# EAGLE design tps610891-boost-to-vin-flashlight-driver-tester-mk-1.0.0 (EAGLE 9.2.2)
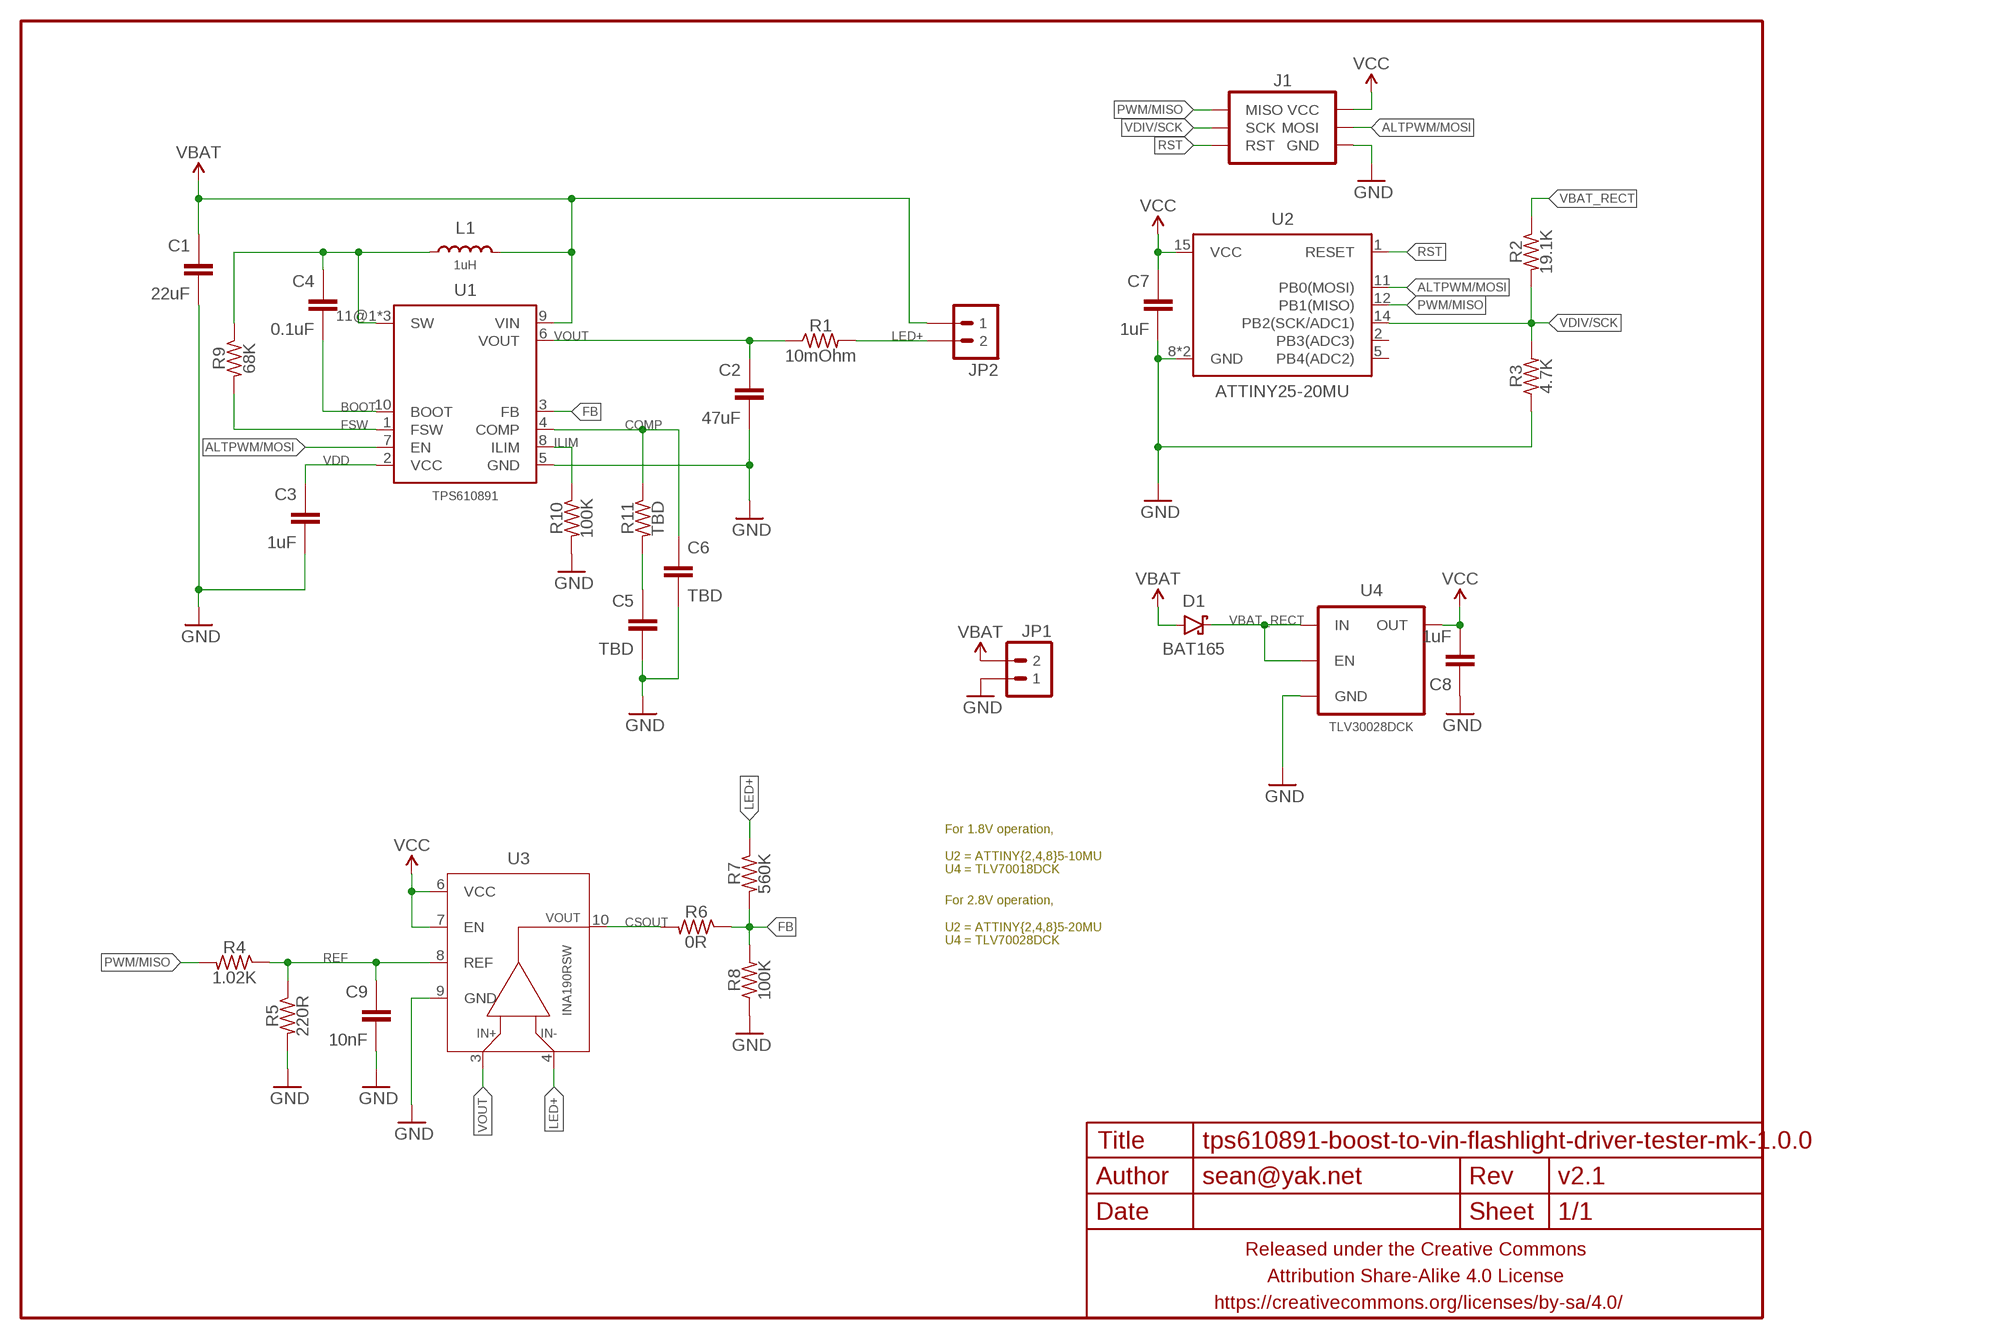
[diagram p0: schematic, sheet 1]

## Parts
C1  22uF  CAPACITOR-CERAMICC1206  [C1206]
C2  47uF  CAPACITOR-CERAMICC1206  [C1206]
C3  1uF  CAPACITOR-CERAMICC0402  [C0402]
C4  0.1uF  CAPACITOR-CERAMICC0402  [C0402]
C5  TBD  CAPACITOR-CERAMICC0402  [C0402]
C6  TBD  CAPACITOR-CERAMICC0402  [C0402]
C7  1uF  CAPACITOR-CERAMICC0402  [C0402]
C8  1uF  CAPACITOR-CERAMICC0402  [C0402]
C9  10nF  CAPACITOR-CERAMICC0402  [C0402]
D1  BAT165  DIODE-SCHOTTKYSOD323  [SOD323-SCHOTTKY]
FRAME1  FRAME-LETTERNO_PACKAGE  [DUMMY]
J1  AVR_SPI_PRG_6PTH  [2X3]
JP1  M021X02_NO_SILK  [1X02_NO_SILK]
JP2  M021X02_NO_SILK  [1X02_NO_SILK]
L1  1uH  INDUCTORXAL60XX  [XAL60XX]
R1  10mOhm  RESISTORR1206  [R1206]
R2  19.1K  RESISTORR0402  [R0402]
R3  4.7K  RESISTORR0402  [R0402]
R4  1.02K  RESISTORR0402  [R0402]
R5  220R  RESISTORR0402  [R0402]
R6  0R  RESISTORR0402  [R0402]
R7  560K  RESISTORR0402  [R0402]
R8  100K  RESISTORR0402  [R0402]
R9  68K  RESISTORR0402  [R0402]
R10  100K  RESISTORR0402  [R0402]
R11  TBD  RESISTORR0402  [R0402]
U1  TPS610891  TPS61089X  [VQFN-11]
U2  ATTINY25-20MU  ATTINY45TINY85-20-QFN  [QFN20]
U3  INA190RSW  [UQFN-10]
U4  TLV30028DCK  V_REG_ENTLV700XXDCR  [SC70]

## Nets
ALTPWM/MOSI: J1.4(MOSI) U1.7(EN) U2.11(PB0(MOSI))
BOOT: C4.2 U1.10(BOOT)
COMP: C6.1 R11.1 U1.4(COMP)
CSOUT: R6.2 U3.10(OUT)
FB: R6.1 R7.2 R8.2 U1.3(FB)
FSW: R9.2 U1.1(FSW)
GND: C1.2 C2.2 C3.2 C5.2 C6.2 C7.2 C8.1 C9.2 J1.6(GND) JP1.1 R3.1 R5.2 R8.1 R10.2 U1.5(GND) U2.8(GND) U2.PAD(GND) U3.9(GND) U4.2(GND)
ILIM: R10.1 U1.8(ILIM)
LED+: JP2.2 R1.2 R7.1 U3.4(VIN-)
N$1: C4.1 L1.P$1 R9.1 U1.11@1(SW) U1.11@2(SW) U1.11@3(SW)
N$5: C5.1 R11.2
PWM/MISO: J1.1(MISO) R4.2 U2.12(PB1(MISO))
REF: C9.1 R4.1 R5.1 U3.8(REF)
RST: J1.5(RST) U2.1(RESET)
VBAT: C1.1 D1.A JP1.2 JP2.1 L1.P$2 U1.9(VIN)
VBAT_RECT: D1.C R2.1 U4.1(IN) U4.3(EN)
VCC: C7.1 C8.2 J1.2(VCC) U2.15(VCC) U3.6(VCC) U3.7(EN) U4.5(OUT)
VDD: C3.1 U1.2(VCC)
VDIV/SCK: J1.3(SCK) R2.2 R3.2 U2.14(PB2(SCK/ADC1))
VOUT: C2.1 R1.1 U1.6(VOUT) U3.3(VIN+)
Unconnected: U2.2(PB3(ADC3)) U2.5(PB4(ADC2))

## Notes on the sheet
- For 1.8V operation,
  
  U2 = ATTINY{2,4,8}5-10MU
  U4 = TLV70018DCK
- For 2.8V operation,
  
  U2 = ATTINY{2,4,8}5-20MU
  U4 = TLV70028DCK

## Library data of the parts
C1-C9 = a_parts:CAPACITOR-CERAMIC: CAPACITOR, European symbol
D1 = a_parts:DIODE-SCHOTTKY: Schottky diodes in SFE's production catalog BAT20J 1A 23V 0.62Vf RB751 120mA 40V 0.37Vf PMEG4005EJ 0.5A 40V 0.42Vf MBRA140 1A 40V 0.5Vf B340A 3A 40V SMA
FRAME1 = a_parts:FRAME-LETTER: Schematic Frame Standard 8.5x11 US Letter frame; DESIGNER: sean@yak.net; VERSION: v2.1
J1 = a_parts:AVR_SPI_PRG_6: AVR ISP 6 Pin This is the reduced ISP connector for AVR programming. Common on Arduino. This footprint will take up less PCB space and can be used with a 10-pin to 6-pin adapter such as SKU: BOB-08508 **Special note about "TEST_POINT" package. The stop mask is on the top side, so if you want your programming test points to be on the bottom of your board, make sure to place this package on the bottom side of the board. This also ensure that the orientation to program from the bottom side will be correct.
JP1 JP2 = a_parts:M02: Standard 2-pin 0.1" header. Use with - straight break away headers ( PRT-00116) - right angle break away headers (PRT-00553) - swiss pins (PRT-00743) - machine pins (PRT-00117) - female headers (PRT-00115) Molex polarized connector foot print use with: PRT-08233 with associated crimp pins and housings. 2.54_SCREWTERM for use with PRT-10571. 3.5mm Screw Terminal footprints for PRT-08084 5mm Screw Terminal footprints for use with PRT-08433
L1 = a_parts:INDUCTOR: Inductors Basic Inductor/Choke - 0603 and 1206. Footprints are not proven and vary greatly between part numbers. SRN6045- 33uH, 20% 1.4A SDR0403-560KL - 56uH, 10%, 500mA RMS/740mA peak
R1-R11 = a_parts:RESISTOR: RESISTOR, American symbol
U1 = a_parts:TPS61089X
U2 = a_parts:ATTINY45: Atmel 8-pin 2/4/8kB flash uC
U3 = a_parts:INA190
U4 = a_parts:V_REG_EN

## Board
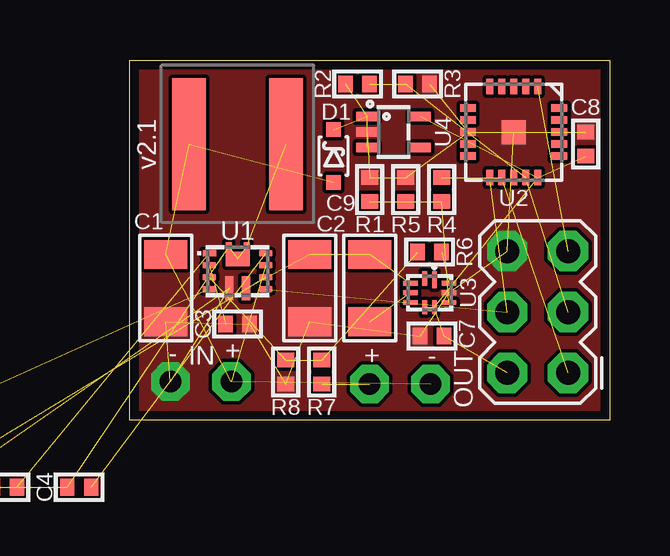
[diagram p1: board, top side]
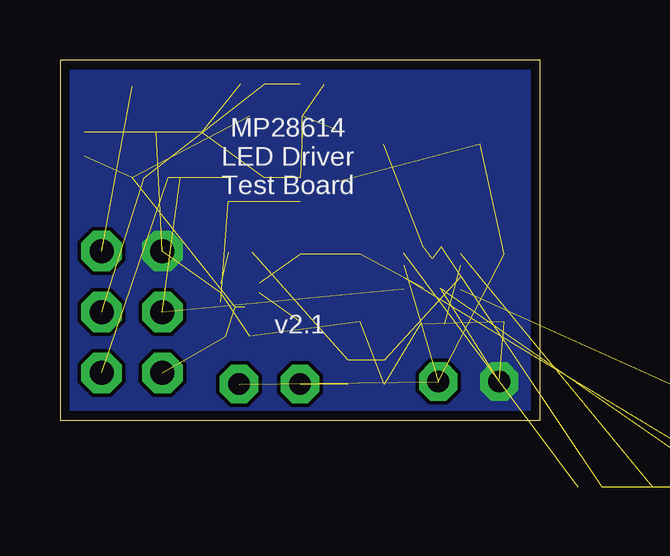
[diagram p2: board, bottom side, seen from below]

Size 20 x 15 mm. Coordinates in mm from the lower left corner, seen from the top.
Outline: 20,0 0,0 0,15 20,15 20,0
Copper layers (1*16): Top 0.035559375mm / dielectric 1.6mm / Bottom 0.035559375mm
Design rules "oshpark-2layer": minimum track width 6mil, minimum drill 10mil, track to track 6mil, track to pad 6mil, pad to pad 6mil, via to via 6mil, smd to smd 0mil, copper to edge 15mil, drill to drill 6mil, minimum pad ring 5mil, minimum via ring 5mil, stop-mask expansion 2.5mil, vias tented up to drill 20mil, thermal gap 10mil

### Footprints (pad centres in the part's own frame; a part is rotated, then mirrored left to right if it is on the bottom)
C1206 = smd 1.2 x 1.8: 1 -1.4,0; 2 1.4,0
C0402 = smd 0.6 x 0.7: 1 -0.5,0; 2 0.5,0
SOD323-SCHOTTKY = smd 0.6 x 0.6: A -1.1,0; C 1.1,0
2X3 = drill 1 pad 1.676 octagon: 1 -2.54,-1.27; 2 -2.54,1.27; 3 0,-1.27; 4 0,1.27; 5 2.54,-1.27; 6 2.54,1.27
1X02_NO_SILK = drill 0.9 pad 1.6 octagon: 1 0,0; 2 2.54,0
XAL60XX = smd 1.4 x 5.5: P$1 -2.02,0; P$2 2.02,0
R1206 = smd 1.2 x 1.8: 1 -1.4,0; 2 1.4,0
R0402 = smd 0.6 x 0.7: 1 -0.5,0; 2 0.5,0
VQFN-11 = smd 0.55 x 0.25: 1 -1.175,0.75; 2 -1.175,0.25; 3 -1.175,-0.25; 4 -1.175,-0.75; 7 1.175,-0.75; 8 1.175,-0.25; 9 1.175,0.25; 10 1.175,0.75 | smd 0.35 x 1: 5 -0.35,-0.7; 6 0.35,-0.7 | smd 1 x 0.62: 11@1 0,0.51 | smd 0.25 x 0.38: 11@2 -0.375,1.01; 11@3 0.375,1.01
QFN20 = smd 0.65 x 0.3: 1 -1.9,1; 2 -1.9,0.5; 3 -1.9,0; 4 -1.9,-0.5; 5 -1.9,-1; 11 1.9,-1; 12 1.9,-0.5; 13 1.9,0; 14 1.9,0.5; 15 1.9,1 | smd 0.3 x 0.65: 6 -1,-1.9; 7 -0.5,-1.9; 8 0,-1.9; 9 0.5,-1.9; 10 1,-1.9; 16 1,1.9; 17 0.5,1.9; 18 0,1.9; 19 -0.5,1.9; 20 -1,1.9 | smd 1 x 1: PAD 0,0
UQFN-10 = smd 0.2 x 0.7: 1 -0.2,-0.55 | smd 0.2 x 0.6: 2 0.2,-0.6; 6 0.2,0.6; 7 -0.2,0.6 | smd 0.6 x 0.2: 3 0.8,-0.4; 4 0.8,0; 5 0.8,0.4; 8 -0.8,0.4; 9 -0.8,0; 10 -0.8,-0.4
SC70 = smd 0.4 x 0.9: 1 -0.65,-1.1; 2 0,-1.1; 3 0.65,-1.1; 4 0.65,1.1; 5 -0.65,1.1

### Placement (x,y rotation side)
C1  1.5,5.5 270 top
C2  7.5,5.5 270 top
C3  4.5,4 0 top
C4  -2.1,-2.8 0 top
C5  -11.4,-2.8 0 top  (outside the outline)
C6  -17.6,-2.8 0 top  (outside the outline)
C7  12.6,3.5 180 top
C8  19,11.5 270 top
C9  10,9.6 90 top
D1  8.5,11 90 top
FRAME1  0,0 0 top
J1  17,4.5 90 top
JP1  1.7,1.6 0 top
JP2  12.54,1.5 180 top
L1  4.5,11.5 180 top
R1  10,5.5 270 top
R2  9.5,14 0 top
R3  12,14 180 top
R4  13,9.6 90 top
R5  11.5,9.6 90 top
R6  12.5,7 0 top
R7  8,2 90 top
R8  6.5,2 90 top
R9  -5.2,-2.8 0 top  (outside the outline)
R10  -8.3,-2.8 0 top  (outside the outline)
R11  -14.5,-2.8 0 top  (outside the outline)
U1  4.5,6.2 0 top
U2  16,12 270 top
U3  12.5,5.3 180 top
U4  11,12 270 top

### Tracks (layer width: path | path; a pad name or v marks a point on that pad's centre or on a via)
ALTPWM/MOSI  (2 unrouted)
BOOT  (1 unrouted)
COMP  (2 unrouted)
CSOUT  (1 unrouted)
FB  (3 unrouted)
FSW  (1 unrouted)
GND  (18 unrouted)
  pour Top (rank 6, no thermals): 0,0 20,0 20,15 0,15
  pour Bottom (rank 6, no thermals): 20,0 0,0 0,15 20,15
ILIM  (1 unrouted)
LED+  (2 unrouted)
N$1  (5 unrouted)
N$5  (1 unrouted)
PWM/MISO  (2 unrouted)
REF  (3 unrouted)
RST  (1 unrouted)
VBAT  (5 unrouted)
VBAT_RECT  (3 unrouted)
VCC  (6 unrouted)
VDD  (1 unrouted)
VDIV/SCK  (3 unrouted)
VOUT  (3 unrouted)

### Text on the board
tPlace: - | IN | + | + | - | OUT
bPlace: MP28614 / LED Driver / Test Board